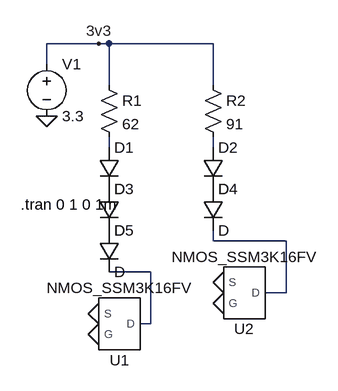
[diagram p0: schematic LEDs.asc]
LEDs.asc, the LTspice schematic file:
Version 4.1
SHEET 1 880 680
WIRE 128 48 48 48
WIRE 144 48 128 48
WIRE 304 48 144 48
WIRE 48 80 48 48
WIRE 144 112 144 48
WIRE 304 112 304 48
WIRE 144 208 144 192
WIRE 304 208 304 192
WIRE 304 352 304 336
WIRE 416 352 304 352
WIRE 208 400 144 400
WIRE 416 432 416 352
WIRE 416 432 384 432
WIRE 208 480 208 400
WIRE 208 480 192 480
FLAG 48 160 0
FLAG 128 48 3v3
FLAG 320 416 0
FLAG 128 464 0
FLAG 128 496 0
FLAG 320 448 0
SYMBOL res 128 96 R0
SYMATTR InstName R1
SYMATTR Value 62
SYMBOL res 288 96 R0
SYMATTR InstName R2
SYMATTR Value 91
SYMBOL diode 128 208 R0
SYMATTR InstName D1
SYMBOL diode 288 208 R0
SYMATTR InstName D2
SYMBOL voltage 48 64 R0
WINDOW 123 0 0 Left 0
WINDOW 39 0 0 Left 0
SYMATTR InstName V1
SYMATTR Value 3.3
SYMBOL diode 128 272 R0
SYMATTR InstName D3
SYMBOL diode 288 272 R0
SYMATTR InstName D4
SYMBOL diode 128 336 R0
SYMATTR InstName D5
SYMBOL NMOS_SSM3K16FV 160 480 R180
SYMATTR InstName U1
SYMBOL NMOS_SSM3K16FV 352 432 R180
SYMATTR InstName U2
TEXT 8 296 Left 2 !.tran 0 1 0 1m

The netlist it stands for:
* LEDs.asc
R1 3v3 N001 62
R2 3v3 N002 91
D1 N001 P001 D
D2 N002 P002 D
V1 3v3 0 3.3
D3 P001 P003 D
D4 P002 N003 D
D5 P003 N004 D
X§U1 N004 0 0 NMOS_SSM3K16FV  ; pins D G S
X§U2 N003 0 0 NMOS_SSM3K16FV  ; pins D G S
.model D D
.lib standard.dio
.tran 0 1 0 1m
.lib C:\Users\adnan\OneDrive\Documents\LTspice\MyLib\SSM3K16FV_PSpice_20160915.lib
.backanno
.end